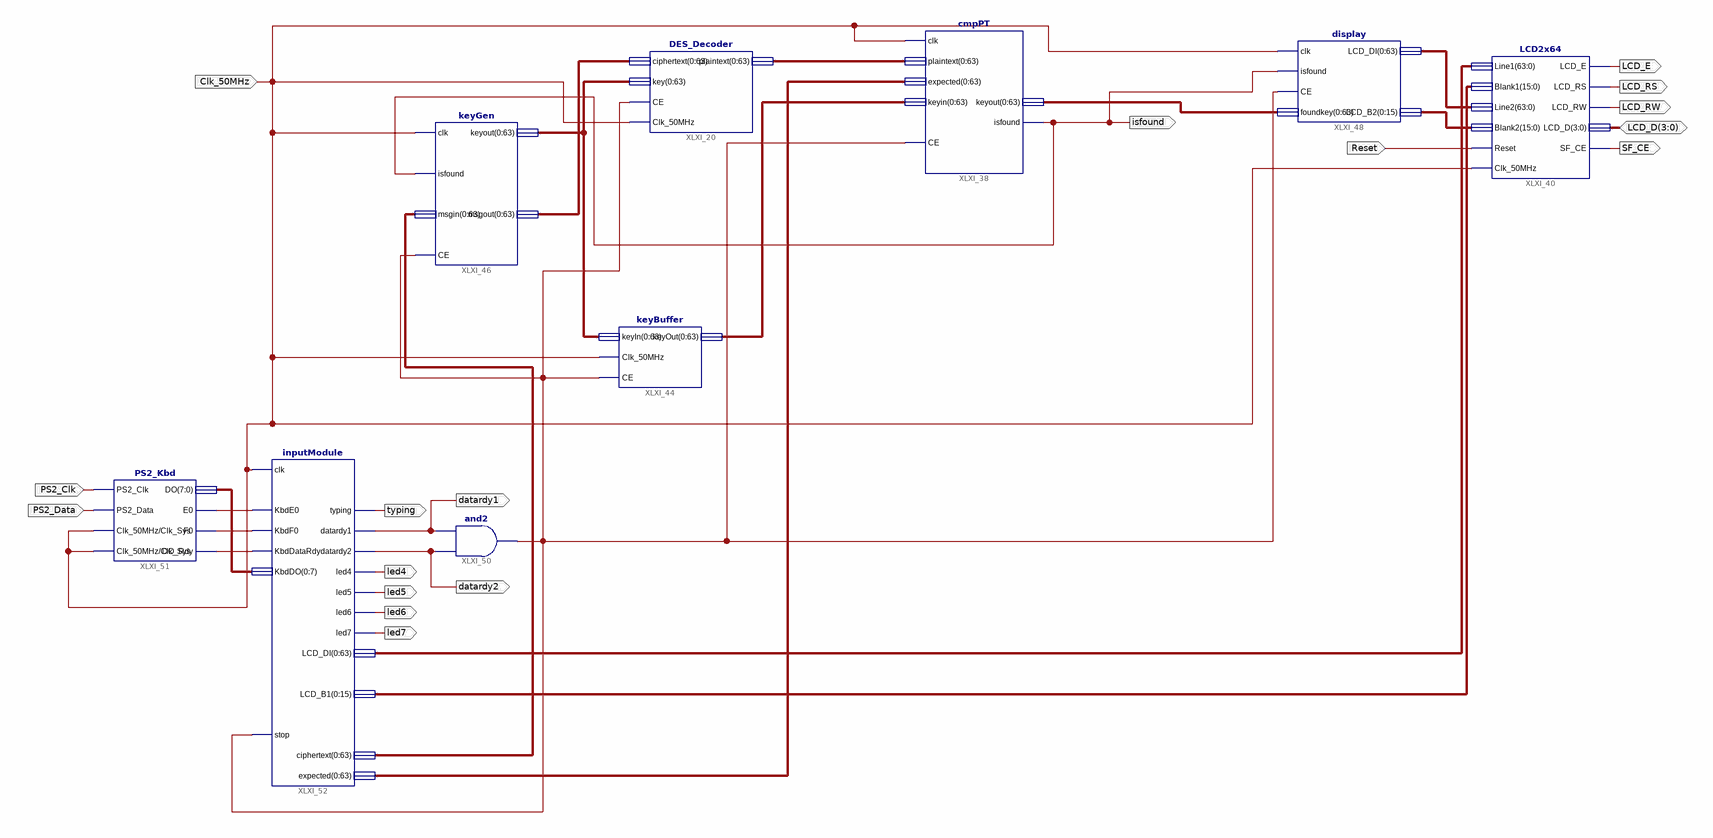
[diagram p0: schematic sheet 1]
// Xilinx ISE schematic DES_Cryptanalysis.sch (spartan3e) as structural Verilog: 9 symbols, 18 ports
module DES_Cryptanalysis (
  input  Reset,
  input  XLXN_78,
  input  Clk_50MHz,
  input  PS2_Clk,
  input  PS2_Data,
  inout  [3:0] LCD_D,
  output isfound,
  output LCD_E,
  output LCD_RW,
  output LCD_RS,
  output SF_CE,
  output typing,
  output led4,
  output led5,
  output led6,
  output led7,
  output datardy1,
  output datardy2
);

  wire XLXN_72, XLXN_73, XLXN_76, XLXN_107;
  wire [7:0] XLXN_77;
  wire [15:0] XLXN_99, XLXN_101;
  wire [63:0] keyout, plaintext, XLXN_57, XLXN_64, XLXN_65, XLXN_100, XLXN_102, XLXN_109, XLXN_111;

  DES_Decoder XLXI_20 (
    .ciphertext({XLXN_65[0], XLXN_65[1], XLXN_65[2], XLXN_65[3], XLXN_65[4], XLXN_65[5], XLXN_65[6], XLXN_65[7], XLXN_65[8], XLXN_65[9], XLXN_65[10], XLXN_65[11], XLXN_65[12], XLXN_65[13], XLXN_65[14], XLXN_65[15], XLXN_65[16], XLXN_65[17], XLXN_65[18], XLXN_65[19], XLXN_65[20], XLXN_65[21], XLXN_65[22], XLXN_65[23], XLXN_65[24], XLXN_65[25], XLXN_65[26], XLXN_65[27], XLXN_65[28], XLXN_65[29], XLXN_65[30], XLXN_65[31], XLXN_65[32], XLXN_65[33], XLXN_65[34], XLXN_65[35], XLXN_65[36], XLXN_65[37], XLXN_65[38], XLXN_65[39], XLXN_65[40], XLXN_65[41], XLXN_65[42], XLXN_65[43], XLXN_65[44], XLXN_65[45], XLXN_65[46], XLXN_65[47], XLXN_65[48], XLXN_65[49], XLXN_65[50], XLXN_65[51], XLXN_65[52], XLXN_65[53], XLXN_65[54], XLXN_65[55], XLXN_65[56], XLXN_65[57], XLXN_65[58], XLXN_65[59], XLXN_65[60], XLXN_65[61], XLXN_65[62], XLXN_65[63]}),
    .key({XLXN_64[0], XLXN_64[1], XLXN_64[2], XLXN_64[3], XLXN_64[4], XLXN_64[5], XLXN_64[6], XLXN_64[7], XLXN_64[8], XLXN_64[9], XLXN_64[10], XLXN_64[11], XLXN_64[12], XLXN_64[13], XLXN_64[14], XLXN_64[15], XLXN_64[16], XLXN_64[17], XLXN_64[18], XLXN_64[19], XLXN_64[20], XLXN_64[21], XLXN_64[22], XLXN_64[23], XLXN_64[24], XLXN_64[25], XLXN_64[26], XLXN_64[27], XLXN_64[28], XLXN_64[29], XLXN_64[30], XLXN_64[31], XLXN_64[32], XLXN_64[33], XLXN_64[34], XLXN_64[35], XLXN_64[36], XLXN_64[37], XLXN_64[38], XLXN_64[39], XLXN_64[40], XLXN_64[41], XLXN_64[42], XLXN_64[43], XLXN_64[44], XLXN_64[45], XLXN_64[46], XLXN_64[47], XLXN_64[48], XLXN_64[49], XLXN_64[50], XLXN_64[51], XLXN_64[52], XLXN_64[53], XLXN_64[54], XLXN_64[55], XLXN_64[56], XLXN_64[57], XLXN_64[58], XLXN_64[59], XLXN_64[60], XLXN_64[61], XLXN_64[62], XLXN_64[63]}),
    .CE(XLXN_107), .Clk_50MHz(Clk_50MHz),
    .plaintext({plaintext[0], plaintext[1], plaintext[2], plaintext[3], plaintext[4], plaintext[5], plaintext[6], plaintext[7], plaintext[8], plaintext[9], plaintext[10], plaintext[11], plaintext[12], plaintext[13], plaintext[14], plaintext[15], plaintext[16], plaintext[17], plaintext[18], plaintext[19], plaintext[20], plaintext[21], plaintext[22], plaintext[23], plaintext[24], plaintext[25], plaintext[26], plaintext[27], plaintext[28], plaintext[29], plaintext[30], plaintext[31], plaintext[32], plaintext[33], plaintext[34], plaintext[35], plaintext[36], plaintext[37], plaintext[38], plaintext[39], plaintext[40], plaintext[41], plaintext[42], plaintext[43], plaintext[44], plaintext[45], plaintext[46], plaintext[47], plaintext[48], plaintext[49], plaintext[50], plaintext[51], plaintext[52], plaintext[53], plaintext[54], plaintext[55], plaintext[56], plaintext[57], plaintext[58], plaintext[59], plaintext[60], plaintext[61], plaintext[62], plaintext[63]}));
  cmpPT XLXI_38 (
    .clk(Clk_50MHz),
    .plaintext({plaintext[0], plaintext[1], plaintext[2], plaintext[3], plaintext[4], plaintext[5], plaintext[6], plaintext[7], plaintext[8], plaintext[9], plaintext[10], plaintext[11], plaintext[12], plaintext[13], plaintext[14], plaintext[15], plaintext[16], plaintext[17], plaintext[18], plaintext[19], plaintext[20], plaintext[21], plaintext[22], plaintext[23], plaintext[24], plaintext[25], plaintext[26], plaintext[27], plaintext[28], plaintext[29], plaintext[30], plaintext[31], plaintext[32], plaintext[33], plaintext[34], plaintext[35], plaintext[36], plaintext[37], plaintext[38], plaintext[39], plaintext[40], plaintext[41], plaintext[42], plaintext[43], plaintext[44], plaintext[45], plaintext[46], plaintext[47], plaintext[48], plaintext[49], plaintext[50], plaintext[51], plaintext[52], plaintext[53], plaintext[54], plaintext[55], plaintext[56], plaintext[57], plaintext[58], plaintext[59], plaintext[60], plaintext[61], plaintext[62], plaintext[63]}),
    .expected({XLXN_111[0], XLXN_111[1], XLXN_111[2], XLXN_111[3], XLXN_111[4], XLXN_111[5], XLXN_111[6], XLXN_111[7], XLXN_111[8], XLXN_111[9], XLXN_111[10], XLXN_111[11], XLXN_111[12], XLXN_111[13], XLXN_111[14], XLXN_111[15], XLXN_111[16], XLXN_111[17], XLXN_111[18], XLXN_111[19], XLXN_111[20], XLXN_111[21], XLXN_111[22], XLXN_111[23], XLXN_111[24], XLXN_111[25], XLXN_111[26], XLXN_111[27], XLXN_111[28], XLXN_111[29], XLXN_111[30], XLXN_111[31], XLXN_111[32], XLXN_111[33], XLXN_111[34], XLXN_111[35], XLXN_111[36], XLXN_111[37], XLXN_111[38], XLXN_111[39], XLXN_111[40], XLXN_111[41], XLXN_111[42], XLXN_111[43], XLXN_111[44], XLXN_111[45], XLXN_111[46], XLXN_111[47], XLXN_111[48], XLXN_111[49], XLXN_111[50], XLXN_111[51], XLXN_111[52], XLXN_111[53], XLXN_111[54], XLXN_111[55], XLXN_111[56], XLXN_111[57], XLXN_111[58], XLXN_111[59], XLXN_111[60], XLXN_111[61], XLXN_111[62], XLXN_111[63]}),
    .keyin({keyout[0], keyout[1], keyout[2], keyout[3], keyout[4], keyout[5], keyout[6], keyout[7], keyout[8], keyout[9], keyout[10], keyout[11], keyout[12], keyout[13], keyout[14], keyout[15], keyout[16], keyout[17], keyout[18], keyout[19], keyout[20], keyout[21], keyout[22], keyout[23], keyout[24], keyout[25], keyout[26], keyout[27], keyout[28], keyout[29], keyout[30], keyout[31], keyout[32], keyout[33], keyout[34], keyout[35], keyout[36], keyout[37], keyout[38], keyout[39], keyout[40], keyout[41], keyout[42], keyout[43], keyout[44], keyout[45], keyout[46], keyout[47], keyout[48], keyout[49], keyout[50], keyout[51], keyout[52], keyout[53], keyout[54], keyout[55], keyout[56], keyout[57], keyout[58], keyout[59], keyout[60], keyout[61], keyout[62], keyout[63]}),
    .isfound(isfound),
    .keyout({XLXN_57[0], XLXN_57[1], XLXN_57[2], XLXN_57[3], XLXN_57[4], XLXN_57[5], XLXN_57[6], XLXN_57[7], XLXN_57[8], XLXN_57[9], XLXN_57[10], XLXN_57[11], XLXN_57[12], XLXN_57[13], XLXN_57[14], XLXN_57[15], XLXN_57[16], XLXN_57[17], XLXN_57[18], XLXN_57[19], XLXN_57[20], XLXN_57[21], XLXN_57[22], XLXN_57[23], XLXN_57[24], XLXN_57[25], XLXN_57[26], XLXN_57[27], XLXN_57[28], XLXN_57[29], XLXN_57[30], XLXN_57[31], XLXN_57[32], XLXN_57[33], XLXN_57[34], XLXN_57[35], XLXN_57[36], XLXN_57[37], XLXN_57[38], XLXN_57[39], XLXN_57[40], XLXN_57[41], XLXN_57[42], XLXN_57[43], XLXN_57[44], XLXN_57[45], XLXN_57[46], XLXN_57[47], XLXN_57[48], XLXN_57[49], XLXN_57[50], XLXN_57[51], XLXN_57[52], XLXN_57[53], XLXN_57[54], XLXN_57[55], XLXN_57[56], XLXN_57[57], XLXN_57[58], XLXN_57[59], XLXN_57[60], XLXN_57[61], XLXN_57[62], XLXN_57[63]}),
    .CE(XLXN_107));
  LCD2x64 XLXI_40 (
    .Line1(XLXN_102), .Blank1(XLXN_101),
    .Line2({XLXN_100[0], XLXN_100[1], XLXN_100[2], XLXN_100[3], XLXN_100[4], XLXN_100[5], XLXN_100[6], XLXN_100[7], XLXN_100[8], XLXN_100[9], XLXN_100[10], XLXN_100[11], XLXN_100[12], XLXN_100[13], XLXN_100[14], XLXN_100[15], XLXN_100[16], XLXN_100[17], XLXN_100[18], XLXN_100[19], XLXN_100[20], XLXN_100[21], XLXN_100[22], XLXN_100[23], XLXN_100[24], XLXN_100[25], XLXN_100[26], XLXN_100[27], XLXN_100[28], XLXN_100[29], XLXN_100[30], XLXN_100[31], XLXN_100[32], XLXN_100[33], XLXN_100[34], XLXN_100[35], XLXN_100[36], XLXN_100[37], XLXN_100[38], XLXN_100[39], XLXN_100[40], XLXN_100[41], XLXN_100[42], XLXN_100[43], XLXN_100[44], XLXN_100[45], XLXN_100[46], XLXN_100[47], XLXN_100[48], XLXN_100[49], XLXN_100[50], XLXN_100[51], XLXN_100[52], XLXN_100[53], XLXN_100[54], XLXN_100[55], XLXN_100[56], XLXN_100[57], XLXN_100[58], XLXN_100[59], XLXN_100[60], XLXN_100[61], XLXN_100[62], XLXN_100[63]}),
    .Blank2({XLXN_99[0], XLXN_99[1], XLXN_99[2], XLXN_99[3], XLXN_99[4], XLXN_99[5], XLXN_99[6], XLXN_99[7], XLXN_99[8], XLXN_99[9], XLXN_99[10], XLXN_99[11], XLXN_99[12], XLXN_99[13], XLXN_99[14], XLXN_99[15]}),
    .LCD_D(LCD_D), .LCD_E(LCD_E), .LCD_RW(LCD_RW), .LCD_RS(LCD_RS), .SF_CE(SF_CE), .Reset(Reset),
    .Clk_50MHz(Clk_50MHz));
  keyBuffer XLXI_44 (
    .keyIn({XLXN_64[0], XLXN_64[1], XLXN_64[2], XLXN_64[3], XLXN_64[4], XLXN_64[5], XLXN_64[6], XLXN_64[7], XLXN_64[8], XLXN_64[9], XLXN_64[10], XLXN_64[11], XLXN_64[12], XLXN_64[13], XLXN_64[14], XLXN_64[15], XLXN_64[16], XLXN_64[17], XLXN_64[18], XLXN_64[19], XLXN_64[20], XLXN_64[21], XLXN_64[22], XLXN_64[23], XLXN_64[24], XLXN_64[25], XLXN_64[26], XLXN_64[27], XLXN_64[28], XLXN_64[29], XLXN_64[30], XLXN_64[31], XLXN_64[32], XLXN_64[33], XLXN_64[34], XLXN_64[35], XLXN_64[36], XLXN_64[37], XLXN_64[38], XLXN_64[39], XLXN_64[40], XLXN_64[41], XLXN_64[42], XLXN_64[43], XLXN_64[44], XLXN_64[45], XLXN_64[46], XLXN_64[47], XLXN_64[48], XLXN_64[49], XLXN_64[50], XLXN_64[51], XLXN_64[52], XLXN_64[53], XLXN_64[54], XLXN_64[55], XLXN_64[56], XLXN_64[57], XLXN_64[58], XLXN_64[59], XLXN_64[60], XLXN_64[61], XLXN_64[62], XLXN_64[63]}),
    .Clk_50MHz(Clk_50MHz), .CE(XLXN_107),
    .keyOut({keyout[0], keyout[1], keyout[2], keyout[3], keyout[4], keyout[5], keyout[6], keyout[7], keyout[8], keyout[9], keyout[10], keyout[11], keyout[12], keyout[13], keyout[14], keyout[15], keyout[16], keyout[17], keyout[18], keyout[19], keyout[20], keyout[21], keyout[22], keyout[23], keyout[24], keyout[25], keyout[26], keyout[27], keyout[28], keyout[29], keyout[30], keyout[31], keyout[32], keyout[33], keyout[34], keyout[35], keyout[36], keyout[37], keyout[38], keyout[39], keyout[40], keyout[41], keyout[42], keyout[43], keyout[44], keyout[45], keyout[46], keyout[47], keyout[48], keyout[49], keyout[50], keyout[51], keyout[52], keyout[53], keyout[54], keyout[55], keyout[56], keyout[57], keyout[58], keyout[59], keyout[60], keyout[61], keyout[62], keyout[63]}));
  keyGen XLXI_46 (
    .clk(Clk_50MHz), .CE(XLXN_107), .isfound(isfound),
    .msgin({XLXN_109[0], XLXN_109[1], XLXN_109[2], XLXN_109[3], XLXN_109[4], XLXN_109[5], XLXN_109[6], XLXN_109[7], XLXN_109[8], XLXN_109[9], XLXN_109[10], XLXN_109[11], XLXN_109[12], XLXN_109[13], XLXN_109[14], XLXN_109[15], XLXN_109[16], XLXN_109[17], XLXN_109[18], XLXN_109[19], XLXN_109[20], XLXN_109[21], XLXN_109[22], XLXN_109[23], XLXN_109[24], XLXN_109[25], XLXN_109[26], XLXN_109[27], XLXN_109[28], XLXN_109[29], XLXN_109[30], XLXN_109[31], XLXN_109[32], XLXN_109[33], XLXN_109[34], XLXN_109[35], XLXN_109[36], XLXN_109[37], XLXN_109[38], XLXN_109[39], XLXN_109[40], XLXN_109[41], XLXN_109[42], XLXN_109[43], XLXN_109[44], XLXN_109[45], XLXN_109[46], XLXN_109[47], XLXN_109[48], XLXN_109[49], XLXN_109[50], XLXN_109[51], XLXN_109[52], XLXN_109[53], XLXN_109[54], XLXN_109[55], XLXN_109[56], XLXN_109[57], XLXN_109[58], XLXN_109[59], XLXN_109[60], XLXN_109[61], XLXN_109[62], XLXN_109[63]}),
    .msgout({XLXN_65[0], XLXN_65[1], XLXN_65[2], XLXN_65[3], XLXN_65[4], XLXN_65[5], XLXN_65[6], XLXN_65[7], XLXN_65[8], XLXN_65[9], XLXN_65[10], XLXN_65[11], XLXN_65[12], XLXN_65[13], XLXN_65[14], XLXN_65[15], XLXN_65[16], XLXN_65[17], XLXN_65[18], XLXN_65[19], XLXN_65[20], XLXN_65[21], XLXN_65[22], XLXN_65[23], XLXN_65[24], XLXN_65[25], XLXN_65[26], XLXN_65[27], XLXN_65[28], XLXN_65[29], XLXN_65[30], XLXN_65[31], XLXN_65[32], XLXN_65[33], XLXN_65[34], XLXN_65[35], XLXN_65[36], XLXN_65[37], XLXN_65[38], XLXN_65[39], XLXN_65[40], XLXN_65[41], XLXN_65[42], XLXN_65[43], XLXN_65[44], XLXN_65[45], XLXN_65[46], XLXN_65[47], XLXN_65[48], XLXN_65[49], XLXN_65[50], XLXN_65[51], XLXN_65[52], XLXN_65[53], XLXN_65[54], XLXN_65[55], XLXN_65[56], XLXN_65[57], XLXN_65[58], XLXN_65[59], XLXN_65[60], XLXN_65[61], XLXN_65[62], XLXN_65[63]}),
    .keyout({XLXN_64[0], XLXN_64[1], XLXN_64[2], XLXN_64[3], XLXN_64[4], XLXN_64[5], XLXN_64[6], XLXN_64[7], XLXN_64[8], XLXN_64[9], XLXN_64[10], XLXN_64[11], XLXN_64[12], XLXN_64[13], XLXN_64[14], XLXN_64[15], XLXN_64[16], XLXN_64[17], XLXN_64[18], XLXN_64[19], XLXN_64[20], XLXN_64[21], XLXN_64[22], XLXN_64[23], XLXN_64[24], XLXN_64[25], XLXN_64[26], XLXN_64[27], XLXN_64[28], XLXN_64[29], XLXN_64[30], XLXN_64[31], XLXN_64[32], XLXN_64[33], XLXN_64[34], XLXN_64[35], XLXN_64[36], XLXN_64[37], XLXN_64[38], XLXN_64[39], XLXN_64[40], XLXN_64[41], XLXN_64[42], XLXN_64[43], XLXN_64[44], XLXN_64[45], XLXN_64[46], XLXN_64[47], XLXN_64[48], XLXN_64[49], XLXN_64[50], XLXN_64[51], XLXN_64[52], XLXN_64[53], XLXN_64[54], XLXN_64[55], XLXN_64[56], XLXN_64[57], XLXN_64[58], XLXN_64[59], XLXN_64[60], XLXN_64[61], XLXN_64[62], XLXN_64[63]}));
  display XLXI_48 (
    .clk(Clk_50MHz), .isfound(isfound), .CE(XLXN_107),
    .foundkey({XLXN_57[0], XLXN_57[1], XLXN_57[2], XLXN_57[3], XLXN_57[4], XLXN_57[5], XLXN_57[6], XLXN_57[7], XLXN_57[8], XLXN_57[9], XLXN_57[10], XLXN_57[11], XLXN_57[12], XLXN_57[13], XLXN_57[14], XLXN_57[15], XLXN_57[16], XLXN_57[17], XLXN_57[18], XLXN_57[19], XLXN_57[20], XLXN_57[21], XLXN_57[22], XLXN_57[23], XLXN_57[24], XLXN_57[25], XLXN_57[26], XLXN_57[27], XLXN_57[28], XLXN_57[29], XLXN_57[30], XLXN_57[31], XLXN_57[32], XLXN_57[33], XLXN_57[34], XLXN_57[35], XLXN_57[36], XLXN_57[37], XLXN_57[38], XLXN_57[39], XLXN_57[40], XLXN_57[41], XLXN_57[42], XLXN_57[43], XLXN_57[44], XLXN_57[45], XLXN_57[46], XLXN_57[47], XLXN_57[48], XLXN_57[49], XLXN_57[50], XLXN_57[51], XLXN_57[52], XLXN_57[53], XLXN_57[54], XLXN_57[55], XLXN_57[56], XLXN_57[57], XLXN_57[58], XLXN_57[59], XLXN_57[60], XLXN_57[61], XLXN_57[62], XLXN_57[63]}),
    .LCD_DI({XLXN_100[0], XLXN_100[1], XLXN_100[2], XLXN_100[3], XLXN_100[4], XLXN_100[5], XLXN_100[6], XLXN_100[7], XLXN_100[8], XLXN_100[9], XLXN_100[10], XLXN_100[11], XLXN_100[12], XLXN_100[13], XLXN_100[14], XLXN_100[15], XLXN_100[16], XLXN_100[17], XLXN_100[18], XLXN_100[19], XLXN_100[20], XLXN_100[21], XLXN_100[22], XLXN_100[23], XLXN_100[24], XLXN_100[25], XLXN_100[26], XLXN_100[27], XLXN_100[28], XLXN_100[29], XLXN_100[30], XLXN_100[31], XLXN_100[32], XLXN_100[33], XLXN_100[34], XLXN_100[35], XLXN_100[36], XLXN_100[37], XLXN_100[38], XLXN_100[39], XLXN_100[40], XLXN_100[41], XLXN_100[42], XLXN_100[43], XLXN_100[44], XLXN_100[45], XLXN_100[46], XLXN_100[47], XLXN_100[48], XLXN_100[49], XLXN_100[50], XLXN_100[51], XLXN_100[52], XLXN_100[53], XLXN_100[54], XLXN_100[55], XLXN_100[56], XLXN_100[57], XLXN_100[58], XLXN_100[59], XLXN_100[60], XLXN_100[61], XLXN_100[62], XLXN_100[63]}),
    .LCD_B2({XLXN_99[0], XLXN_99[1], XLXN_99[2], XLXN_99[3], XLXN_99[4], XLXN_99[5], XLXN_99[6], XLXN_99[7], XLXN_99[8], XLXN_99[9], XLXN_99[10], XLXN_99[11], XLXN_99[12], XLXN_99[13], XLXN_99[14], XLXN_99[15]}));
  PS2_Kbd XLXI_51 (
    .PS2_Clk(PS2_Clk), .PS2_Data(PS2_Data), .Clk_50MHz(Clk_50MHz), .E0(XLXN_72), .F0(XLXN_73),
    .DO_Rdy(XLXN_76), .DO(XLXN_77), .Clk_Sys(Clk_50MHz));
  inputModule XLXI_52 (
    .KbdE0(XLXN_72), .KbdF0(XLXN_73), .KbdDataRdy(XLXN_76), .clk(Clk_50MHz), .stop(XLXN_107),
    .KbdDO(XLXN_77), .typing(typing), .datardy1(datardy1), .datardy2(datardy2), .led4(led4), .led5(led5),
    .led6(led6), .led7(led7), .LCD_DI(XLXN_102), .LCD_B1(XLXN_101),
    .ciphertext({XLXN_109[0], XLXN_109[1], XLXN_109[2], XLXN_109[3], XLXN_109[4], XLXN_109[5], XLXN_109[6], XLXN_109[7], XLXN_109[8], XLXN_109[9], XLXN_109[10], XLXN_109[11], XLXN_109[12], XLXN_109[13], XLXN_109[14], XLXN_109[15], XLXN_109[16], XLXN_109[17], XLXN_109[18], XLXN_109[19], XLXN_109[20], XLXN_109[21], XLXN_109[22], XLXN_109[23], XLXN_109[24], XLXN_109[25], XLXN_109[26], XLXN_109[27], XLXN_109[28], XLXN_109[29], XLXN_109[30], XLXN_109[31], XLXN_109[32], XLXN_109[33], XLXN_109[34], XLXN_109[35], XLXN_109[36], XLXN_109[37], XLXN_109[38], XLXN_109[39], XLXN_109[40], XLXN_109[41], XLXN_109[42], XLXN_109[43], XLXN_109[44], XLXN_109[45], XLXN_109[46], XLXN_109[47], XLXN_109[48], XLXN_109[49], XLXN_109[50], XLXN_109[51], XLXN_109[52], XLXN_109[53], XLXN_109[54], XLXN_109[55], XLXN_109[56], XLXN_109[57], XLXN_109[58], XLXN_109[59], XLXN_109[60], XLXN_109[61], XLXN_109[62], XLXN_109[63]}),
    .expected({XLXN_111[0], XLXN_111[1], XLXN_111[2], XLXN_111[3], XLXN_111[4], XLXN_111[5], XLXN_111[6], XLXN_111[7], XLXN_111[8], XLXN_111[9], XLXN_111[10], XLXN_111[11], XLXN_111[12], XLXN_111[13], XLXN_111[14], XLXN_111[15], XLXN_111[16], XLXN_111[17], XLXN_111[18], XLXN_111[19], XLXN_111[20], XLXN_111[21], XLXN_111[22], XLXN_111[23], XLXN_111[24], XLXN_111[25], XLXN_111[26], XLXN_111[27], XLXN_111[28], XLXN_111[29], XLXN_111[30], XLXN_111[31], XLXN_111[32], XLXN_111[33], XLXN_111[34], XLXN_111[35], XLXN_111[36], XLXN_111[37], XLXN_111[38], XLXN_111[39], XLXN_111[40], XLXN_111[41], XLXN_111[42], XLXN_111[43], XLXN_111[44], XLXN_111[45], XLXN_111[46], XLXN_111[47], XLXN_111[48], XLXN_111[49], XLXN_111[50], XLXN_111[51], XLXN_111[52], XLXN_111[53], XLXN_111[54], XLXN_111[55], XLXN_111[56], XLXN_111[57], XLXN_111[58], XLXN_111[59], XLXN_111[60], XLXN_111[61], XLXN_111[62], XLXN_111[63]}));
  and XLXI_50 (XLXN_107, datardy2, datardy1);
endmodule
